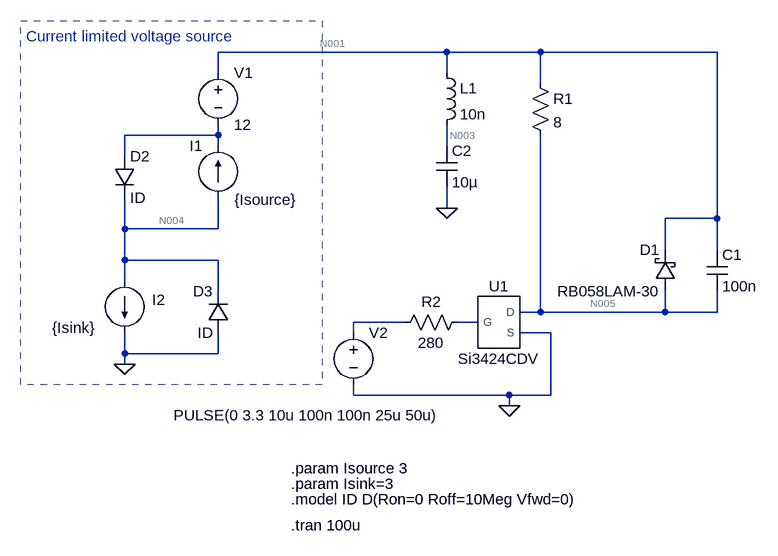
[diagram p0: schematic LTSpice.asc]
LTSpice.asc, the LTspice schematic file:
Version 4
SHEET 1 880 680
WIRE 240 -192 -112 -192
WIRE 384 -192 240 -192
WIRE 656 -192 384 -192
WIRE -112 -160 -112 -192
WIRE 240 -160 240 -192
WIRE 384 -144 384 -192
WIRE -112 -64 -112 -80
WIRE -112 -64 -256 -64
WIRE -112 -48 -112 -64
WIRE 240 -48 240 -80
WIRE -256 -32 -256 -64
WIRE 240 48 240 16
WIRE 656 64 656 -192
WIRE 656 64 576 64
WIRE -256 80 -256 32
WIRE -112 80 -112 32
WIRE -112 80 -256 80
WIRE 576 112 576 64
WIRE 656 112 656 64
WIRE -256 128 -256 80
WIRE -112 128 -256 128
WIRE -256 160 -256 128
WIRE -112 176 -112 128
WIRE 384 208 384 -64
WIRE 384 208 352 208
WIRE 576 208 576 176
WIRE 576 208 384 208
WIRE 656 208 656 176
WIRE 656 208 576 208
WIRE 176 224 96 224
WIRE 288 224 256 224
WIRE 96 240 96 224
WIRE 400 240 352 240
WIRE -256 272 -256 240
WIRE -112 272 -112 240
WIRE -112 272 -256 272
WIRE -256 288 -256 272
WIRE 96 336 96 320
WIRE 336 336 96 336
WIRE 400 336 400 240
WIRE 400 336 336 336
WIRE 336 352 336 336
FLAG 336 352 0
FLAG 240 48 0
FLAG -256 288 0
SYMBOL voltage 96 224 R0
WINDOW 3 -277 143 Left 2
WINDOW 123 0 0 Left 0
WINDOW 39 0 0 Left 0
SYMATTR Value PULSE(0 3.3 10u 100n 100n 25u 50u)
SYMATTR InstName V2
SYMBOL Si3424CDV 320 224 R0
SYMATTR InstName U1
SYMBOL res 272 208 R90
WINDOW 0 0 56 VBottom 2
WINDOW 3 32 56 VTop 2
SYMATTR InstName R2
SYMATTR Value 280
SYMBOL schottky 592 176 R180
WINDOW 0 24 64 Left 2
WINDOW 3 24 0 Left 2
SYMATTR InstName D1
SYMATTR Value RB058LAM-30
SYMATTR Description Diode
SYMATTR Type diode
SYMBOL cap 640 112 R0
SYMATTR InstName C1
SYMATTR Value 100n
SYMBOL cap 224 -48 R0
SYMATTR InstName C2
SYMATTR Value 10µ
SYMBOL res 368 -160 R0
SYMATTR InstName R1
SYMATTR Value 8
SYMBOL voltage -112 -176 R0
WINDOW 123 0 0 Left 0
WINDOW 39 0 0 Left 0
SYMATTR InstName V1
SYMATTR Value 12
SYMBOL current -112 32 R180
WINDOW 0 24 80 Left 2
WINDOW 3 -121 -3 Left 2
WINDOW 123 0 0 Left 0
WINDOW 39 0 0 Left 0
SYMATTR InstName I1
SYMATTR Value {Isource}
SYMBOL current -256 160 R0
WINDOW 0 42 29 Left 2
WINDOW 3 -112 72 Left 2
WINDOW 123 0 0 Left 0
WINDOW 39 0 0 Left 0
SYMATTR InstName I2
SYMATTR Value {Isink}
SYMBOL diode -272 -32 R0
SYMATTR InstName D2
SYMATTR Value ID
SYMBOL diode -96 240 R180
WINDOW 0 24 64 Left 2
WINDOW 3 24 0 Left 2
SYMATTR InstName D3
SYMATTR Value ID
SYMBOL ind 224 -176 R0
SYMATTR InstName L1
SYMATTR Value 10n
TEXT 0 536 Left 2 !.tran 100u
TEXT 0 448 Left 2 !.param Isource 3
TEXT 0 472 Left 2 !.param Isink=3
TEXT 0 496 Left 2 !.model ID D(Ron=0 Roff=10Meg Vfwd=0)
TEXT -408 -216 Left 2 ;Current limited voltage source
RECTANGLE Normal 48 320 -416 -240 2

The netlist it stands for:
* LTSpice.asc
V2 N006 0 PULSE(0 3.3 10u 100n 100n 25u 50u)
XU1 N005 N007 0 Si3424CDV  ; pins D G S
R2 N007 N006 280
D1 N005 N001 RB058LAM-30
C1 N001 N005 100n
C2 N003 0 10µ
R1 N001 N005 8
V1 N001 N002 12
I1 N004 N002 {Isource}
I2 N004 0 {Isink}
D2 N002 N004 ID
D3 0 N004 ID
L1 N001 N003 10n
.model D D
.lib standard.dio
.tran 100u
.param Isource 3
.param Isink=3
.model ID D(Ron=0 Roff=10Meg Vfwd=0)
* Current limited voltage source
.lib Si3424CDV_PS.lib
.backanno
.end

* Results of the author's LTspice run, read from the files saved beside the schematic
* Operating Point, zero values left out:
*   V(n005) = 12 V
*   V(n001) = 12 V
*   V(n003) = 12 V
*   V(n004) = -3 mV
*   I(D2) = 3 A
*   I(D3) = 3 A
*   I(L1) = 1.776 pA
*   I(I1) = 3 A
*   I(I2) = 3 A
*   I(R1) = 459.7 pA
*   I(V1) = -461.7 pA
*   Ix(u1:D) = 439.9 pA
*   Ix(u1:S) = -438.5 pA
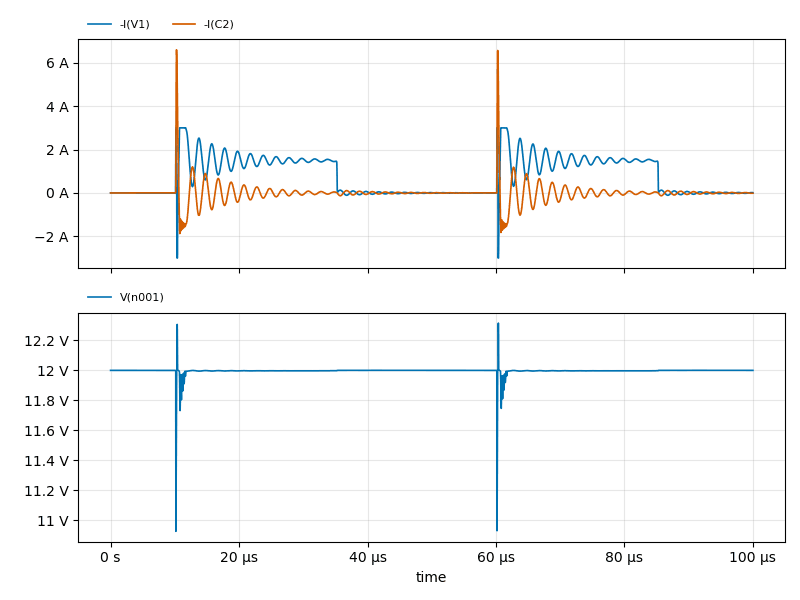
[diagram p1: Transient Analysis of LTSpice.asc, plotted from the saved traces]
* Transient Analysis, 1 run:
*   -I(V1): min -3 A, max 3 A, average 771.6 mA, rms 1.167 A, last 12.1 mA
*   -I(C2): min -1.876 A, max 6.596 A, average -206.7 µA, rms 528 mA, last -12.68 mA
*   V(n001): min 10.93 V, max 12.31 V, average 12 V, rms 12 V, last 12 V